# Altium schematic sheet PUSH-BUTTON & ENCODER.SchDoc
size A3; ApprovedBy: SI; CheckedBy: SI; Author: SI; CompanyName: KundenName; DrawnBy: SI; Engineer: SI; Organization: Sven Ingelfinger IT-Trainer; Address1: Ruländerstraße 5; Address2: 74235; Address3: Erlenbach; SheetNumber: 2; SheetTotal: 3; OrganizationDescription: Altium Trainer & Consultant
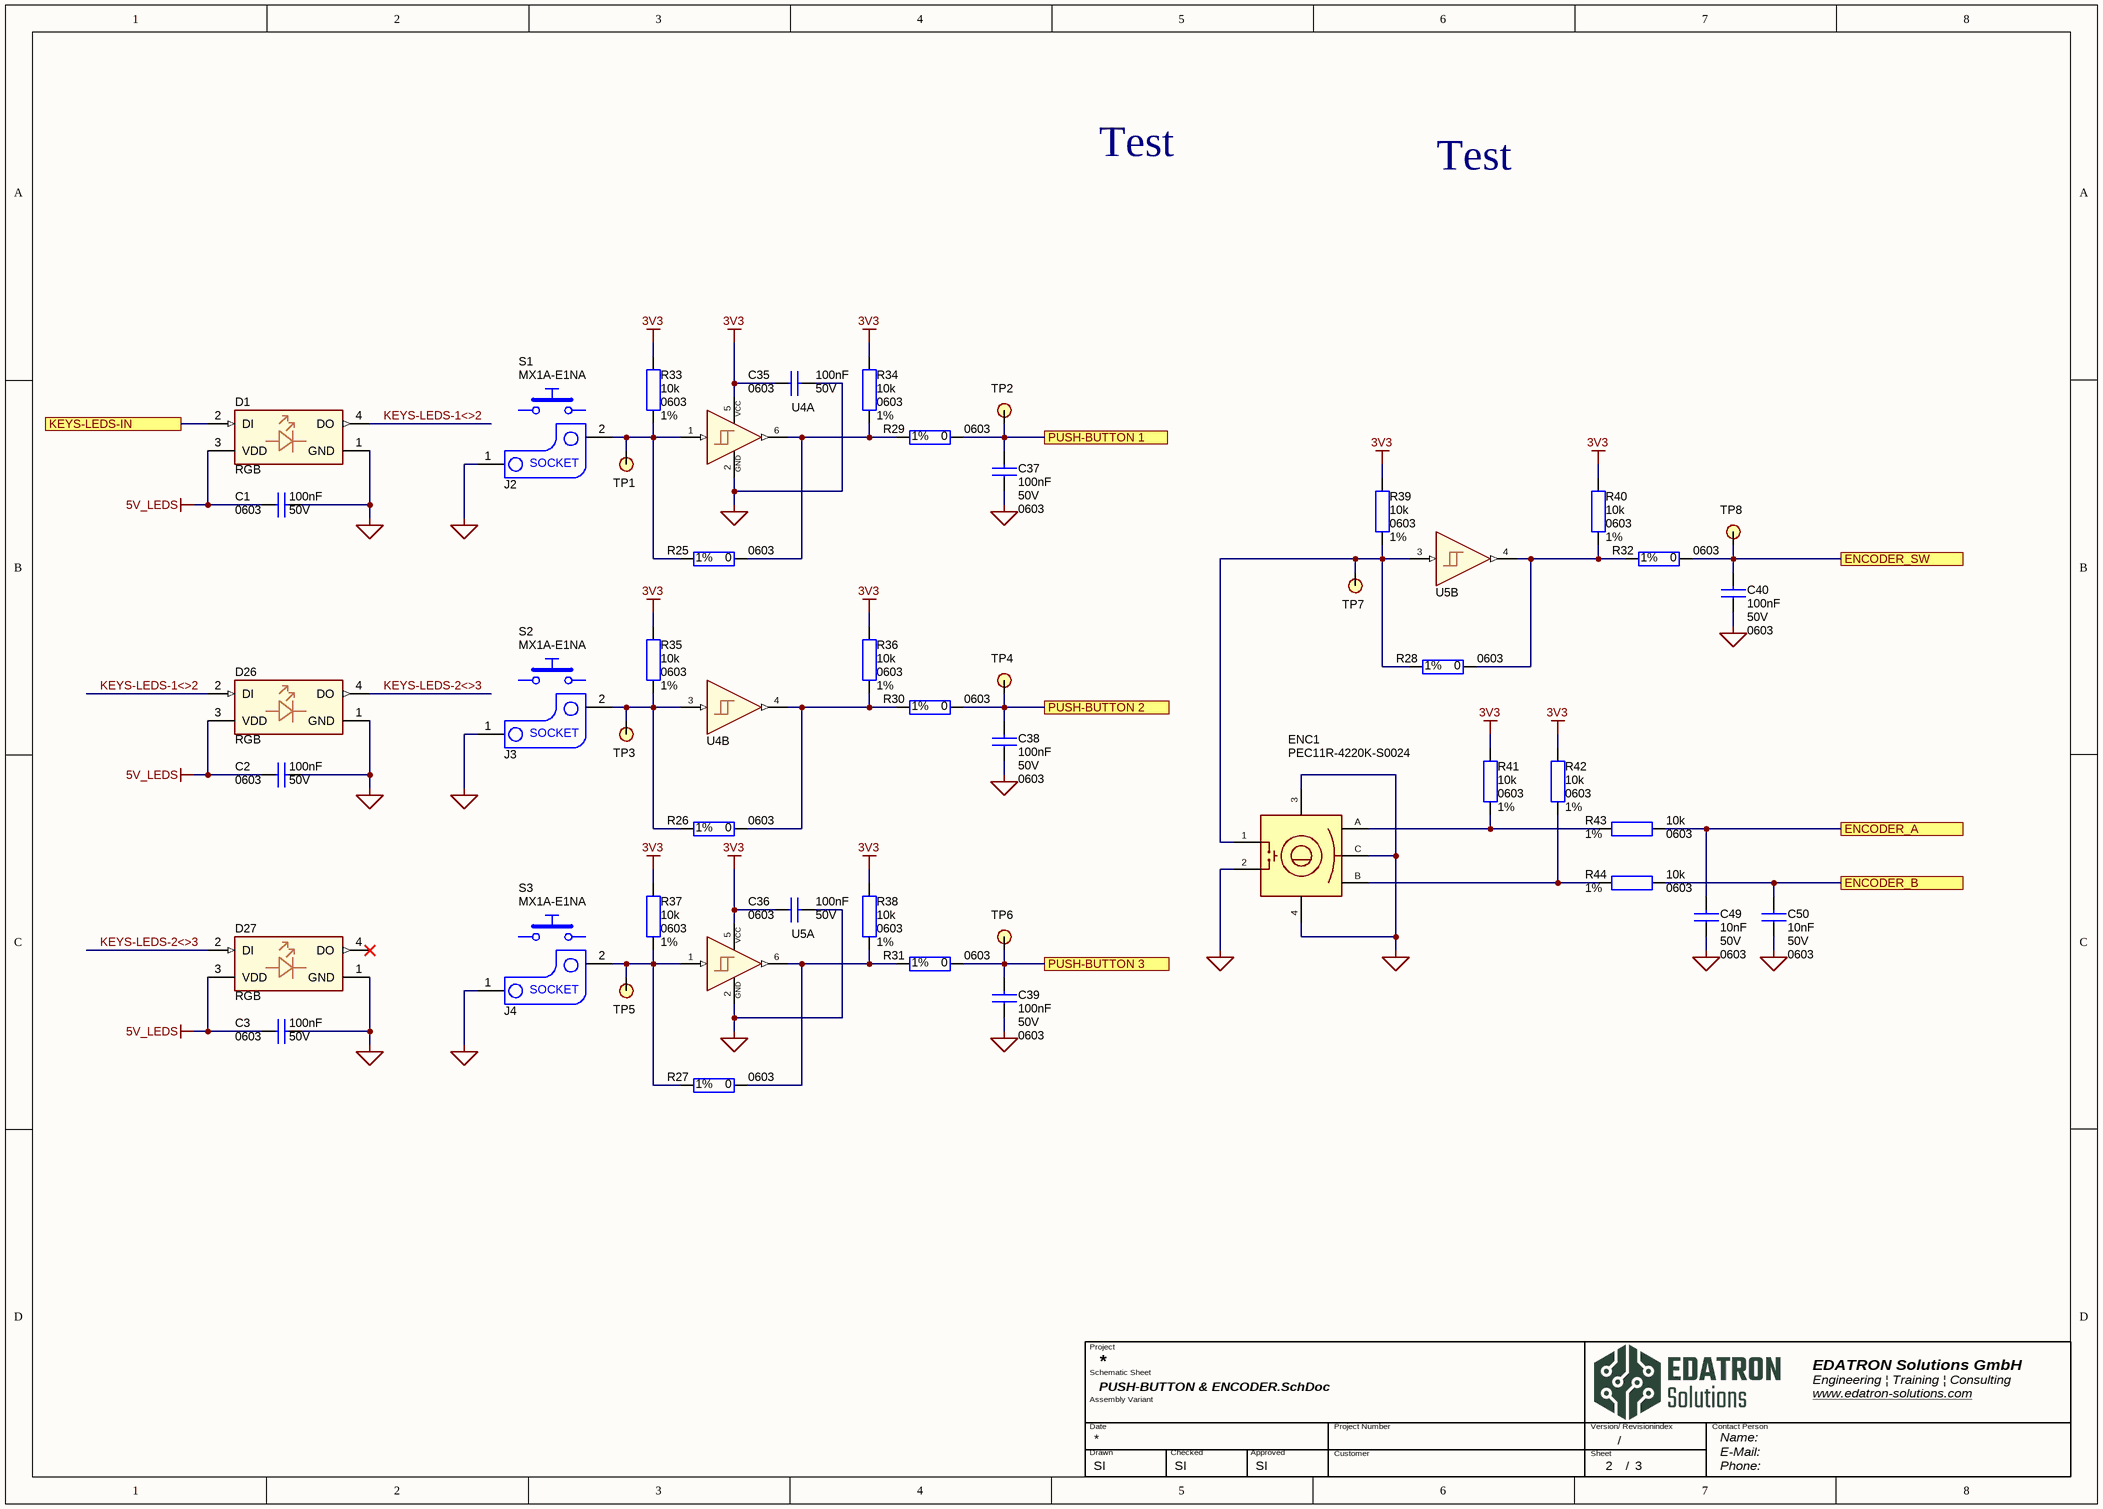
[diagram p0: PUSH-BUTTON & ENCODER.SchDoc]

## Parts
C1  value 100nF  Voltage: 50V  Case/Package: 0603  [CAPC0603X37L]  (hidden comment: C0603C104K5RACTU)
C2  value 100nF  Voltage: 50V  Case/Package: 0603  [CAPC0603X37L]  (hidden comment: C0603C104K5RACTU)
C3  value 100nF  Voltage: 50V  Case/Package: 0603  [CAPC0603X37L]  (hidden comment: C0603C104K5RACTU)
C35  value 100nF  Voltage: 50V  Case/Package: 0603  [CAPC0603X37L]  (hidden comment: C0603C104K5RACTU)
C36  value 100nF  Voltage: 50V  Case/Package: 0603  [CAPC0603X37L]  (hidden comment: C0603C104K5RACTU)
C37  value 100nF  Voltage: 50V  Case/Package: 0603  [CAPC0603X37L]  (hidden comment: C0603C104K5RACTU)
C38  value 100nF  Voltage: 50V  Case/Package: 0603  [CAPC0603X37L]  (hidden comment: C0603C104K5RACTU)
C39  value 100nF  Voltage: 50V  Case/Package: 0603  [CAPC0603X37L]  (hidden comment: C0603C104K5RACTU)
C40  value 100nF  Voltage: 50V  Case/Package: 0603  [CAPC0603X37L]  (hidden comment: C0603C104K5RACTU)
C49  value 10nF  Voltage: 50V  Case/Package: 0603  [CAPC0603X37L]  (hidden comment: C0603C103K5RACTU)
C50  value 10nF  Voltage: 50V  Case/Package: 0603  [CAPC0603X37L]  (hidden comment: C0603C103K5RACTU)
D1  Color: RGB  [OPSCO_SK6812MINI-E-012]  (hidden comment: SK6812MINI-E-012)
D26  Color: RGB  [OPSCO_SK6812MINI-E-012]  (hidden comment: SK6812MINI-E-012)
D27  Color: RGB  [OPSCO_SK6812MINI-E-012]  (hidden comment: SK6812MINI-E-012)
ENC1  PEC11R-4220K-S0024  [PEC11R-4220K-S0024]
J2  CPG151101S11-16  [KAILH_CPG151101S11-16]  (value not drawn)
J3  CPG151101S11-16  [KAILH_CPG151101S11-16]  (value not drawn)
J4  CPG151101S11-16  [KAILH_CPG151101S11-16]  (value not drawn)
R25  value 0  Case/Package: 0603  Tolerance: 1%  [RESC0603X21L]  (hidden comment: RC0603FR-070RL)
R26  value 0  Case/Package: 0603  Tolerance: 1%  [RESC0603X21L]  (hidden comment: RC0603FR-070RL)
R27  value 0  Case/Package: 0603  Tolerance: 1%  [RESC0603X21L]  (hidden comment: RC0603FR-070RL)
R28  value 0  Case/Package: 0603  Tolerance: 1%  [RESC0603X21L]  (hidden comment: RC0603FR-070RL)
R29  value 0  Case/Package: 0603  Tolerance: 1%  [RESC0603X21L]  (hidden comment: RC0603FR-070RL)
R30  value 0  Case/Package: 0603  Tolerance: 1%  [RESC0603X21L]  (hidden comment: RC0603FR-070RL)
R31  value 0  Case/Package: 0603  Tolerance: 1%  [RESC0603X21L]  (hidden comment: RC0603FR-070RL)
R32  value 0  Case/Package: 0603  Tolerance: 1%  [RESC0603X21L]  (hidden comment: RC0603FR-070RL)
R33  value 10k  Case/Package: 0603  Tolerance: 1%  [RESC0603X21L]  (hidden comment: RC0603FR-0733KL)
R34  value 10k  Case/Package: 0603  Tolerance: 1%  [RESC0603X21L]  (hidden comment: RC0603FR-0733KL)
R35  value 10k  Case/Package: 0603  Tolerance: 1%  [RESC0603X21L]  (hidden comment: RC0603FR-0733KL)
R36  value 10k  Case/Package: 0603  Tolerance: 1%  [RESC0603X21L]  (hidden comment: RC0603FR-0733KL)
R37  value 10k  Case/Package: 0603  Tolerance: 1%  [RESC0603X21L]  (hidden comment: RC0603FR-0733KL)
R38  value 10k  Case/Package: 0603  Tolerance: 1%  [RESC0603X21L]  (hidden comment: RC0603FR-0733KL)
R39  value 10k  Case/Package: 0603  Tolerance: 1%  [RESC0603X21L]  (hidden comment: RC0603FR-0733KL)
R40  value 10k  Case/Package: 0603  Tolerance: 1%  [RESC0603X21L]  (hidden comment: RC0603FR-0733KL)
R41  value 10k  Case/Package: 0603  Tolerance: 1%  [RESC0603X21L]  (hidden comment: RC0603FR-0733KL)
R42  value 10k  Case/Package: 0603  Tolerance: 1%  [RESC0603X21L]  (hidden comment: RC0603FR-0733KL)
R43  value 10k  Case/Package: 0603  Tolerance: 1%  [RESC0603X21L]  (hidden comment: RC0603FR-0733KL)
R44  value 10k  Case/Package: 0603  Tolerance: 1%  [RESC0603X21L]  (hidden comment: RC0603FR-0733KL)
S1  MX1A-E1NA  [KAILH_SWITCH_MX_COMPATIBEL]  (mechanical)
S2  MX1A-E1NA  [KAILH_SWITCH_MX_COMPATIBEL]  (mechanical)
S3  MX1A-E1NA  [KAILH_SWITCH_MX_COMPATIBEL]  (mechanical)
TP1  SMD-Testpoint  [SMT-1.00mm Testpoint]  (value not drawn)
TP2  SMD-Testpoint  [SMT-1.00mm Testpoint]  (value not drawn)
TP3  SMD-Testpoint  [SMT-1.00mm Testpoint]  (value not drawn)
TP4  SMD-Testpoint  [SMT-1.00mm Testpoint]  (value not drawn)
TP5  SMD-Testpoint  [SMT-1.00mm Testpoint]  (value not drawn)
TP6  SMD-Testpoint  [SMT-1.00mm Testpoint]  (value not drawn)
TP7  SMD-Testpoint  [SMT-1.00mm Testpoint]  (value not drawn)
TP8  SMD-Testpoint  [SMT-1.00mm Testpoint]  (value not drawn)
U4  SN74LVC2G17DCKR  [SOT23-6P65_200X210X110L36X22L]  (value not drawn)  (parts A,B of 2)
U5  SN74LVC2G17DCKR  [SOT23-6P65_200X210X110L36X22L]  (value not drawn)  (parts A,B of 2)

## Ports
ENCODER_A, ENCODER_B, ENCODER_SW, KEYS-LEDS-IN, PUSH-BUTTON 1, PUSH-BUTTON 2, PUSH-BUTTON 3

## Nets
3V3: C35.1 C36.1 R33.1 R34.1 R35.1 R36.1 R37.1 R38.1 R39.1 R40.1 R41.1 R42.1 U4.5(VCC) U5.5(VCC)
5V_LEDS: C1.1 C2.1 C3.1 D1.3(VDD) D26.3(VDD) D27.3(VDD)
GND: C1.2 C2.2 C3.2 C35.2 C36.2 C37.1 C38.1 C39.1 C40.1 C49.1 C50.1 D1.1(GND) D26.1(GND) D27.1(GND) ENC1.2 ENC1.3(MNT_1) ENC1.4(MNT_2) ENC1.C(COMMON) J2.1 J3.1 J4.1 U4.2(GND) U5.2(GND)
ENCODER_A: C49.2 R43.2 ; port ENCODER_A
ENCODER_B: C50.2 R44.2 ; port ENCODER_B
ENCODER_SW: C40.2 R32.2 TP8.1 ; port ENCODER_SW
KEYS-LEDS-1<>2: D1.4(DO) D26.2(DI)
KEYS-LEDS-2<>3: D26.4(DO) D27.2(DI)
KEYS-LEDS-IN: D1.2(DI) ; port KEYS-LEDS-IN
PUSH-BUTTON 1: C37.2 R29.2 TP2.1 ; port PUSH-BUTTON 1
PUSH-BUTTON 2: C38.2 R30.2 TP4.1 ; port PUSH-BUTTON 2
PUSH-BUTTON 3: C39.2 R31.2 TP6.1 ; port PUSH-BUTTON 3
NetENC1_1: ENC1.1 R28.1 R39.2 TP7.1 U5.3(2A)
NetENC1_A: ENC1.A(CHANNEL_A) R41.2 R43.1
NetENC1_B: ENC1.B(CHANNEL_B) R42.2 R44.1
NetJ2_2: J2.2 R25.1 R33.2 TP1.1 U4.1(1A)
NetJ3_2: J3.2 R26.1 R35.2 TP3.1 U4.3(2A)
NetJ4_2: J4.2 R27.1 R37.2 TP5.1 U5.1(1A)
NetR25_2: R25.2 R29.1 R34.2 U4.6(1Y)
NetR26_2: R26.2 R30.1 R36.2 U4.4(2Y)
NetR27_2: R27.2 R31.1 R38.2 U5.6(1Y)
NetR28_2: R28.2 R32.1 R40.2 U5.4(2Y)

Not connected (* = marked no-connect by the designer): D27 4(DO)*

## Notes on the sheet
- Test
- Project
- Schematic Sheet
- EDATRON Solutions GmbH
- Engineering | Training | Consulting
- www.edatron-solutions.com <http://www.edatron-solutions.com>
- Assembly Variant
- Drawn
- Date
- Checked
- Approved
- Project Number
- Customer
- Version/ Revisionindex
- Sheet
- /
- Contact Person
- Name:
- E-Mail:
- Phone:
- (in symbol CMP-00191-06) SOCKET

## Library data of the parts
C1-C3 C35-C40 = CMP-00094-12: CAPACITOR 100 nF 0603 X7R 50V 10%; Manufacturer 1: Kemet; Comment Designer: can be substituted same values other manufacturer; Operating Temperature (max): 125°C; Manufacturer 1 Part Number: C0603C104K5RACTU; Dielectric: X7R; Operating Temperature (min): -55°C; Tolerance: 10%
C49 C50 = CMP-00082-12: CAPACITOR 10 nF 0603 X7R 50V 10%; Manufacturer 1: Kemet; Comment Designer: can be substituted same values other manufacturer; Operating Temperature (max): 125°C; Manufacturer 1 Part Number: C0603C103K5RACTU; Dielectric: X7R; Operating Temperature (min): -55°C; Tolerance: 10%
D1 D26 D27 = CMP-00204-03: SMD RGB LEDs(Built-in IC) ROHS  - Reverse Mount; Manufacturer 1: OPSCO Optoelectronics; Voltage: 5V; Case/Package: 2020; Value: SK6812MINI-E; Operating Temperature (min): -40°C; Manufacturer 1 Part Number: SK6812MINI-E-012; Operating Temperature (max): 85°C
ENC1 = CMP-00197-03: Rotary Position Encoder; Manufacturer 1: Bourns; Voltage: 5V; Value: PEC11R; Manufacturer 1 Part Number: PEC11R-4220K-S0024; Operating Temperature (min): -30°C; Operating Temperature (max): 70°C
J2-J4 = CMP-00191-06: Socket PG1511 KeySwitches Contact Ⅲ (MX Series Cherry); Manufacturer 1: DONGGUAN CITY KAIHUA ELECTRONICS; Voltage: 12V; Comment Designer: Clone of Cerry MX Series; Rated Current: 10mA; Operating Temperature (max): 125°C; ComponentLink1Description: Information; Case/Package: PG1511 14.65mm X 5.99mm; Manufacturer 1 Part Number: CPG151101S11-16; Operating Temperature (min): -55°C; ComponentLink1URL: https://deskthority.net/wiki/Kailh_PG1511_series; Value: CPG151101S11
R25-R32 = CMP-009-00178-12: RESISTOR 0R 1% 0603 100mW; Manufacturer 1: Yageo; Comment Designer: can be substituted same values other manufacturers; Manufacturer 1 Part Number: RC0603FR-070RL; Power: 100mW; Operating Temperature (min): -55°C; Operating Temperature (max): 125°C
R33-R44 = CMP-009-00319-12: RESISTOR 33K 1% 0603 100mW; Manufacturer 1: Yageo; Comment Designer: can be substituted same values other manufacturers; Operating Temperature (min): -55°C; Manufacturer 1 Part Number: RC0603FR-0733KL; Operating Temperature (max): 125°C; Power: 100mW
S1-S3 = CMP-00190-05: Cherry MX1A-E1NA - Schnappbefestigung im Rahmen; Rated Current: 10mA; Voltage: 12V; Comment Designer: can be substituted by other Switches form Kailh or Cherry MX Series; Operating Temperature (max): 70°C; Manufacturer 1: Cherry; Operating Temperature (min): -40°C; Manufacturer 1 Part Number: MX1A-E1NA; Value: MX1A-E1NA
TP1-TP8 = CMP-00196-01: SMT-TESTPOINT; Case/Package: 1.00mm DIA
U4 U5 = CMP-00194-01: SN74LVC2G17 Dual Schmitt-Trigger Buffer; Manufacturer 1: Texas Instruments; Prop. Delay@Nom-Sup: 5.4ns; Max Supply Voltage: 5.5V; Min Supply Voltage: 1.65V; Manufacturer 1 Part Number: SN74LVC2G17DCKR; Value: SN74LVC2G17; Case/Package: SOT-23; Type: Schmitt Trigger; Operating Temperature (max): 125°C; Operating Temperature (min): -40°C; PartId: 1